# EAGLE design displacement sensor (EAGLE 6.4)
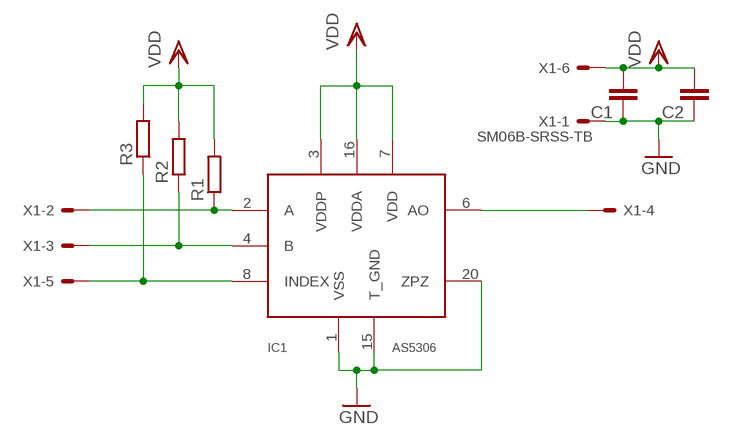
[diagram p0: schematic, sheet 1]

## Parts
C1  C-EUC0402K  [C0402K]
C2  C-EUC0402K  [C0402K]
IC1  AS5306  [TSSOP20]
R1  R-EU_R0402  [R0402]
R2  R-EU_R0402  [R0402]
R3  R-EU_R0402  [R0402]
X1  SM06B-SRSS-TB  [SM06B-SRSS-TB]

## Nets
GND: C1.1 C2.1 IC1.1(VSS) IC1.15(T_GND) IC1.20(ZPZ) X1.1
N$1: IC1.6(AO) X1.4
N$3: IC1.2(A) R1.1 X1.2
N$4: IC1.4(B) R2.1 X1.3
N$5: IC1.8(INDEX) R3.1 X1.5
VDD: C1.2 C2.2 IC1.3(VDDP) IC1.7(VDD) IC1.16(VDDA) R1.2 R2.2 R3.2 X1.6

## Library data of the parts
C1 C2 = rcl:C-EU: CAPACITOR, European symbol
IC1 = jas new (2):AS5306
R1-R3 = rcl:R-EU_: RESISTOR, European symbol
X1 = con-jst2:?M06B-SRSS-TB: Disconnectable Crimp style connector, 1.0mm pitch 6 contacts

## Board
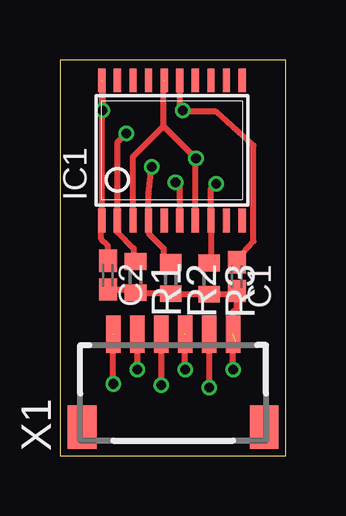
[diagram p1: board, top side]
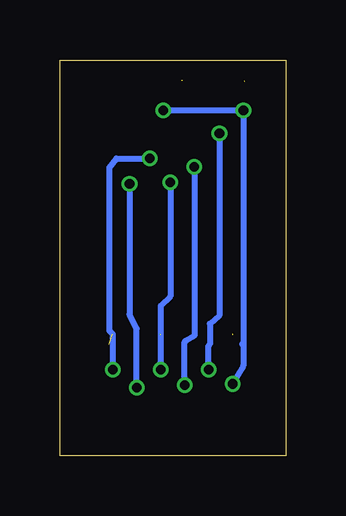
[diagram p2: board, bottom side, seen from below]

Size 9.43 x 16.51 mm. Coordinates in mm from the lower left corner, seen from the top.
Outline: 0,0 9.43,0 9.43,16.51 0,16.51 0,0
Copper layers (1*16): Top 0.035mm / dielectric 1.5mm / Bottom 0.035mm
Design rules: minimum track width 0.125mm, minimum drill 0.2mm, track to track 0.125mm, track to pad 0.125mm, pad to pad 0.125mm, via to via 0.125mm, smd to smd 0.125mm, copper to edge 0.3mm, drill to drill 0.2mm, minimum pad ring 0.2mm, minimum via ring 0.125mm, stop-mask expansion 0.075mm, vias tented up to drill 0mil, thermal gap 0.2mm

### Footprints (pad centres in the part's own frame; a part is rotated, then mirrored left to right if it is on the bottom)
C0402K = smd 0.925 x 0.74: 1 -0.6,0; 2 0.6,0
TSSOP20 = smd 0.305 x 0.991: 1 -2.925,-2.918; 2 -2.275,-2.918; 3 -1.625,-2.918; 4 -0.975,-2.918; 5 -0.325,-2.918; 6 0.325,-2.918; 7 0.975,-2.918; 8 1.625,-2.918; 9 2.275,-2.918; 10 2.925,-2.918; 11 2.925,2.918; 12 2.275,2.918; 13 1.625,2.918; 14 0.975,2.918; 15 0.325,2.918; 16 -0.325,2.918; 17 -0.975,2.918; 18 -1.625,2.918; 19 -2.275,2.918; 20 -2.925,2.918
R0402 = smd 0.7 x 0.9: 1 -0.65,0; 2 0.65,0
SM06B-SRSS-TB = smd 0.6 x 1.55: 1 -2.5,2.975; 2 -1.5,2.975; 3 -0.5,2.975; 4 0.5,2.975; 5 1.5,2.975; 6 2.5,2.975 | smd 1.2 x 1.8: FIT@1 -3.8,-0.9; FIT@2 3.8,-0.9

### Placement (x,y rotation side)
C1  7.38,7.47 270 top
C2  2,7.54 270 top
IC1  4.67,12.73 0 top
R1  3.16,7.45 270 top
R2  4.63,7.41 270 top
R3  6.23,7.39 270 top
X1  4.72,2.1 0 top

### Tracks (layer width: path | path; a pad name or v marks a point on that pad's centre or on a via)
GND  (via drill 0.4)  (2 unrouted)
  Top 0.254: IC1.20 1.78,15.65 v1.78,14.4 | IC1.15 5,14.4 v5.12,14.4 5.17,14.35 6.52,14.35 8.07,12.95 8.07,8.95 7.38,8.21 C1.1 | 1.73,15.6 1.75,15.57 IC1.1 1.73,9.79 1.73,9.05 2,8.77 C2.1 | v2.23,3 2.23,5 | 2.23,5 2.23,5.05 2.27,5.1 2.27,5.05 2.23,5 | 2.23,5 2.18,5
  Bottom 0.254: v5.12,14.4 v1.78,14.4 1.78,4.7 | 1.78,4.7 1.83,4.65 | 1.78,4.7 1.78,3.75 v2.23,3
N$1  (via drill 0.4)  (1 unrouted)
  Top 0.254: IC1.6 5,11.22 v4.82,11.4 | v5.22,3.6 5.22,5.05 5.17,5.1 5.17,5
  Bottom 0.254: v4.82,11.4 4.82,6.65 5.22,6.25 v5.22,3.6
N$3  (via drill 0.4)
  Top 0.254: R1.1 3.08,8.18 3.08,8.65 2.4,9.32 IC1.2 2.4,13.07 v2.77,13.45 | X1.2 v3.23,3.6
  Bottom 0.254: v2.77,13.45 2.77,5.85 3.18,5.5 3.18,4.65 3.23,4.6 v3.23,3.6
N$4  (via drill 0.4)
  Top 0.254: R2.1 4.32,8.37 4.32,8.65 3.7,9.28 IC1.4 3.7,10.93 v3.83,12.05 | X1.3 v4.22,2.95
  Bottom 0.254: v3.83,12.05 3.83,5 4.17,4.8 4.22,4.75 v4.22,2.95
N$5  (via drill 0.4)
  Top 0.254: R3.1 6.3,8.11 IC1.8 6.3,11.12 v6.52,11.35 | X1.5 v6.22,2.85
  Bottom 0.254: v6.52,11.35 6.52,5.9 6.22,5.3 v6.22,2.85
VDD  (via drill 0.4)  (2 unrouted)
  Top 0.254: IC1.3 3.05,12.47 4.32,13.75 | 4.32,13.75 4.32,15.65 | IC1.7 5.65,12.43 | 5.65,12.43 4.32,13.75 | C2.2 3.02,6.93 R1.2 4.59,6.8 R2.2 6.21,6.76 R3.2 7.24,6.74 C1.2 7.38,6.15 7.22,6 X1.6 v7.22,3.6 | 7.38,4.66 7.38,4.65 | v5.67,12.4 5.65,12.43
  Bottom 0.254: 5.65,12.43 v5.67,12.4 7.07,12.4 7.38,12 7.38,5.22 X1.6 v7.22,3.6